# Altium project openEPS.PrjPcb (part 4 of 5)

## Sheet LTC3119 Buck Boost Converter.SchDoc
size Letter; Organization: Altium Limited; Address1: L3, 12a Rodborough Rd; Address2: Frenchs Forest; Address3: NSW; Address4: Australia 2086; CopyrightYear: 2019
Used 4 times, as channels U_Solar Power Converter with MPPT1/U_LTC3119 Buck Boost Converter, U_Solar Power Converter with MPPT2/U_LTC3119 Buck Boost Converter, U_Solar Power Converter with MPPT3/U_LTC3119 Buck Boost Converter, U_Solar Power Converter with MPPT4/U_LTC3119 Buck Boost Converter. Parts and nets are listed once, with the designators drawn on the sheet.
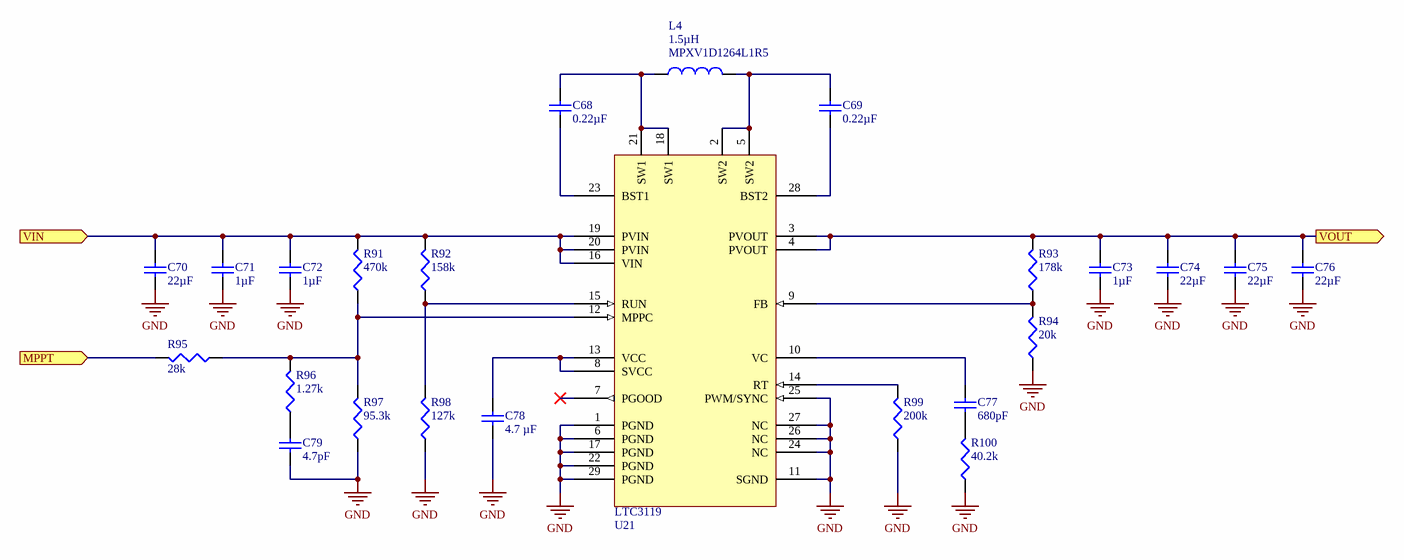
[diagram p17: LTC3119 Buck Boost Converter.SchDoc]

### Parts
C68  value 0.22µF  [TDK-CGA3E]  (hidden comment: Cap)
C69  value 0.22µF  [TDK-CGA3E]  (hidden comment: Cap)
C70  value 22µF  [TDK-C3225]  (hidden comment: Cap)
C71  value 1µF  [TY-0603A]  (hidden comment: Cap)
C72  value 1µF  [TY-0603A]  (hidden comment: Cap)
C73  value 1µF  [TY-0603A]  (hidden comment: Cap)
C74  value 22µF  [TDK-C3225]  (hidden comment: Cap)
C75  value 22µF  [TDK-C3225]  (hidden comment: Cap)
C76  value 22µF  [TDK-C3225]  (hidden comment: Cap)
C77  value 680pF  [TDK-CGA2B]  (hidden comment: Cap)
C78  value 4.7 µF  [MUR-GRM188]  (hidden comment: Cap)
C79  value 4.7pF  [TDK-CGA2B]  (hidden comment: Cap)
L4  value 1.5µH  Manufacturer Part Number: MPXV1D1264L1R5  [KEM-MPXV1D1264L100]  (hidden comment: Inductor)
R91  value 470k  [VSH-0402MCS]  (hidden comment: Res3)
R92  value 158k  [TEC-RP731E]  (hidden comment: Res3)
R93  value 178k  [TEC-RP731E]  (hidden comment: Res3)
R94  value 20k  [TEC-RP731E]  (hidden comment: Res3)
R95  value 28k  [TEC-RP731E]  (hidden comment: Res3)
R96  value 1.27k  [TEC-RP731E]  (hidden comment: Res3)
R97  value 95.3k  [TEC-RP731E]  (hidden comment: Res3)
R98  value 127k  [TEC-RP731E]  (hidden comment: Res3)
R99  value 200k  [TEC-RP731E]  (hidden comment: Res3)
R100  value 40.2k  [TEC-RP731E]  (hidden comment: Res3)
U21  LTC3119  [LT-05-08-1712C]

### Ports
MPPT (in), VIN (in), VOUT (out)

### Nets
GND: C70.1 C71.1 C72.1 C73.1 C74.1 C75.1 C76.1 C78.1 C79.1 R94.1 R97.1 R98.1 R99.1 R100.1 U21.1(PGND) U21.6(PGND) U21.11(SGND) U21.17(PGND) U21.22(PGND) U21.24(NC) U21.25(PWM/SYNC) U21.26(NC) U21.27(NC) U21.29(PGND)
MPPT: R95.2 ; port MPPT
VIN: C70.2 C71.2 C72.2 R91.2 R92.2 U21.16(VIN) U21.19(PVIN) U21.20(PVIN) ; port VIN
VOUT: C73.2 C74.2 C75.2 C76.2 R93.2 U21.3(PVOUT) U21.4(PVOUT) ; port VOUT
NetC68_1: C68.1 U21.23(BST1)
NetC68_2: C68.2 L4.1 U21.18(SW1) U21.21(SW1)
NetC69_1: C69.1 U21.28(BST2)
NetC69_2: C69.2 L4.2 U21.2(SW2) U21.5(SW2)
NetC77_1: C77.1 R100.2
NetC77_2: C77.2 U21.10(VC)
NetC78_2: C78.2 U21.8(SVCC) U21.13(VCC)
NetC79_2: C79.2 R96.1
NetR91_1: R91.1 R95.1 R96.2 R97.2 U21.12(MPPC)
NetR92_1: R92.1 R98.2 U21.15(RUN)
NetR93_1: R93.1 R94.2 U21.9(FB)
NetR99_2: R99.2 U21.14(RT)

Not connected (* = marked no-connect by the designer): U21 7(PGOOD)*

### Channels
U_Solar Power Converter with MPPT1/U_LTC3119 Buck Boost Converter: designators end in _1; ports MPPT=NetQ2_6 VIN=NetC70_1_2 VOUT=NetC73_1_2
U_Solar Power Converter with MPPT2/U_LTC3119 Buck Boost Converter: designators end in _2; ports MPPT=NetQ2_3 VIN=NetC70_2_2 VOUT=NetC73_2_2
U_Solar Power Converter with MPPT3/U_LTC3119 Buck Boost Converter: designators end in _3; ports MPPT=NetQ1_6 VIN=NetC70_3_2 VOUT=NetC73_3_2
U_Solar Power Converter with MPPT4/U_LTC3119 Buck Boost Converter: designators end in _4; ports MPPT=NetQ1_3 VIN=NetC70_4_2 VOUT=NetC73_4_2

### Notes on the sheet
- (the "License"); you may not use or redistribute this file except in compliance with the License. You
- This file and the information within it are licensed under the terms of the Apache License, Version 2.0
- Copyright
- Unless required by applicable law or agreed to in writing, content distributed under the License is
- distributed on an "AS IS" BASIS, WITHOUT WARRANTIES OR CONDITIONS OF ANY KIND,
- either express or implied. See the License for the specific language governing permissions and
- limitations under the License.
- may obtain a copy of the License at:
- http://www.apache.org/licenses/LICENSE-2.0
- Title
- Size:
- Date:
- Letter
- Number:
- Time:
- Revision:
- Sheet
- of
- University of Alberta
- Deptartment of Electrical
- and Computer Engineering
- Edmonton AB, Canada
- T6G 1H9
- File:

### Library data of the parts
C68 C69 = PC-TDK-02393: CAP CER 0.22UF 50V X7R 0603; Manufacturer Part Number: CGA3E3X7R1H224K080AB; Index: 2393; Designator: C?; Tolerance: ±10%; Published: 2016-03-16; LatestRevisionDate: 2016-03-16; LatestRevisionNote: ...; PackageReference: 0603 (1608 Metric); Publisher: AlbertaSat; PackageDescription: Radial Cap, Thru-Hole; 2 Leads; 0.3 in Pin Spacing; Part Number: PC-TDK-02393; Supplier Part Number 1: 445-6926-1-ND; Supplier 1: Digi-key; Supplier Link: http://www.digikey.ca/product-search/en?keywords=445-6926-1-ND; Voltage - Rated: 50V; Temperature Coefficient: X7R; Applications: Automotive; Operating Temperature: -55°C ~ 125°C
C70 C74-C76 = PC-TDK-02965: CAP CER 22UF 25V X7R 1210; Manufacturer Part Number: C3225X7R1E226M250AB; Index: 2965; Designator: C?; Tolerance: ±20%; Code_IEC: 3225; Published: 2022-10-26; LatestRevisionDate: 2022-10-26; LatestRevisionNote: ...; PackageReference: 1210 (3225 Metric); Publisher: AlbertaSat; PackageDescription: Chip Capacitor, 2-Leads, Body 3.20x2.50mm, IPC Low Density; Part Number: PC-TDK-02965; Supplier Part Number 1: 445-181602-1-ND; Supplier 1: Digi-key; Supplier Part Number 2: 810-C3225X7R1EM250AB; Supplier 2: Mouser; Supplier Link: #https://www.digikey.ca/en/products/detail/tdk-corporation/C3225X7R1E226M250AB/9991387#; Voltage - Rated: 25V; Temperature Coefficient: X7R; Applications: General Purpose; Code_JEITA: 1210; Operating Temperature: -55°C ~ 125°C
C71-C73 = PC-TY-00404: CAP CER 1UF 50V X7R 0603; Manufacturer Part Number: UMK107AB7105KA-T; Index: 404; Designator: C?; Tolerance: ±10%; Published: 2016-03-13; LatestRevisionDate: 2016-03-13; LatestRevisionNote: ...; PackageReference: 0603 (1608 Metric); Publisher: AlbertaSat; PackageDescription: Chip Capacitor, 2-Leads, Body 1.60x0.80mm, IPC Low Density; Part Number: PC-TY-00404; Supplier Part Number 1: 587-3247-1-ND; Supplier 1: Digi-key; Supplier Link: http://www.digikey.ca/product-search/en?keywords=587-3247-1-ND; Voltage-Rated: 50V; Temperature Coefficient: X7R; Application: General Purpose; Operating Temperature: -55°C ~ 125°C
C77 = PC-TDK-01417: CAP CER 680PF 100V C0G 0402; Manufacturer Part Number: CGA2B1C0G2A681J050BC; Index: 1417; Designator: C?; Tolerance: ±5%; Temperature Coefficient: NP0; Published: 2016-03-16; LatestRevisionDate: 2016-03-16; LatestRevisionNote: ...; PackageReference: 0402 (1005 Metric); Publisher: AlbertaSat; PackageDescription: Radial Cap, Thru-Hole; 2 Leads; 0.3 in Pin Spacing; Part Number: PC-TDK-01417; Supplier Part Number 1: 445-172680-1-ND; Supplier 1: Digi-key; Supplier Link: http://www.digikey.ca/product-search/en?keywords=445-172680-1-ND; Voltage - Rated: 100V; Applications: Automotive; Operating Temperature: -55°C ~ 125°C
C78 = 10165: CAP CER 4.7UF 16V X7R 0603; Part Number: 10165; Manufacturer Part Number: GRM188Z71C475KE21D; Designator: C?; Tolerance: ±10%; Voltage - Rated: 25V; Published: 8-Jun-2000; LatestRevisionDate: 17-Jul-2002; LatestRevisionNote: Re-released for DXP Platform.; PackageReference: 0603 (1608 Metric); Publisher: Altium Limited; PackageDescription: Chip Capacitor, 2-Leads, Body 1.60x0.80mm, IPC Low Density; Supplier Part Number 1: 490-GRM188Z71C475KE21DCT-ND; Supplier 1: Digi-Key; Supplier Link: #https://www.digikey.ca/en/products/detail/murata-electronics/GRM188Z71C475KE21D/13401930#; Temperature Coefficient: X7R; Application: General Purpose; Operating Temperature: -55°C ~ 125°C; Supplier 2: Mouser; Supplier Part Number 2: 81-GRM188Z71C475KE1D
C79 = PC-TDK-01056: CAP CER 4.7PF 50V NP0 0402; Manufacturer Part Number: CGA2B2NP01H4R7C050BA; Index: 1056; Designator: C?; Tolerance: ±0.25pF; Published: 2016-03-16; LatestRevisionDate: 2016-03-16; LatestRevisionNote: ...; PackageReference: 0402 (1005 Metric); Publisher: AlbertaSat; PackageDescription: Radial Cap, Thru-Hole; 2 Leads; 0.3 in Pin Spacing; Part Number: PC-TDK-01056; Supplier Part Number 1: 445-12140-1-ND; Supplier 1: Digi-key; Supplier Link: http://www.digikey.ca/product-search/en?keywords=445-12140-1-ND; Voltage - Rated: 50V; Temperature Coefficient: NP0; Applications: Automotive; Operating Temperature: -55°C ~ 150°C
L4 = PL-KEM-03168: FIXED IND 1.5UH 28.8A 2.9MOHM SM; Code_IEC: 1005; Index: 3168; Designator: L?; Tolerance: ±20%; Published: 2022-11-26; LatestRevisionDate: 2023-05-04; LatestRevisionNote: Added operating temperature; PackageReference: 0.520" L x 0.492" W (13.20mm x 12.50mm); Publisher: AlbertaSat; PackageDescription: Precision Wire Wound Inductor, 2-Leads, Body 13.20x12.50mm, IPC Low Density; Code_JEITA: 0402; Part Number: PL-KEM-03168; Supplier Part Number 1: 399-MPXV1D1264L1R5CT-ND; Supplier 1: Digi-key; Supplier Part Number 2: 80-MPXV1D1264L1R5; Supplier 2: Mouser; Supplier Link: #https://www.digikey.ca/products/en?keywords=399-MPXV1D1264L100CT-ND#; Operating Temperature: -55°C ~ 155°C
R91 = PR-VSH-00330: RES 470K OHM 0.1% 1/16W 0402; Manufacturer Part Number: MCS0402MD4703BE000; Index: 330; Designator: R?; Power - Rated: 0.063W, 1/16W; Temperature Coefficient: ±25ppm/°C; Published: 2023-02-16; LatestRevisionDate: 2023-02-16; LatestRevisionNote: ...; PackageReference: 0402 (1005 Metric); Publisher: AlbertaSat; PackageDescription: Chip Resistor, 2-Leads, Body 1.00x0.50mm, IPC Low Density; Part Number: PR-VSH-00330; Supplier Part Number 1: 62AJ8660; Supplier 1: Newark; Supplier Link: https://www.digikey.ca/products/en?keywords=541-MCS0402MD4703BE000DKR-ND; Tolerance: ±0.1%; Operating Temperature: -55°C ~ 155°C
R92 = 905: RES 158K OHM 0.1% 1/10W 0402; Part Number: 905; Manufacturer Part Number: RP73PF1E158KBTD; Designator: R?; Temperature Coefficient: ±25ppm/°C; Power (Watts): 0.1W, 1/10W; Published: 8-Jun-2000; LatestRevisionDate: 29-May-2009; LatestRevisionNote: IPC-7351 Footprint Added.; PackageReference: 0402 (1005 Metric); Publisher: Altium Limited; PackageDescription: Chip Resistor, 2-Leads, Body 1.00x0.50mm, IPC Low Density; Supplier Part Number 1: A127530CT-ND; Supplier 1: Digi-Key; Supplier Link: http://www.digikey.ca/product-search/en?keywords=A127530CT-ND; Tolerance: ±0.1%; Operating Temperature: -55°C ~ 155°C
R93 = 910: RES 178K OHM 0.1% 1/10W 0402; Part Number: 910; Manufacturer Part Number: RP73PF1E178KBTD; Designator: R?; Temperature Coefficient: ±25ppm/°C; Power (Watts): 0.1W, 1/10W; Published: 8-Jun-2000; LatestRevisionDate: 29-May-2009; LatestRevisionNote: IPC-7351 Footprint Added.; PackageReference: 0402 (1005 Metric); Publisher: Altium Limited; PackageDescription: Chip Resistor, 2-Leads, Body 1.00x0.50mm, IPC Low Density; Supplier Part Number 1: A127535CT-ND; Supplier 1: Digi-Key; Supplier Link: http://www.digikey.ca/product-search/en?keywords=A127535CT-ND; Tolerance: ±0.1%; Operating Temperature: -55°C ~ 155°C
R94 = 819: RES 20K OHM 0.1% 1/10W 0402; Part Number: 819; Manufacturer Part Number: RP73PF1E20KBTD; Designator: R?; Temperature Coefficient: ±25ppm/°C; Power (Watts): 0.1W, 1/10W; Published: 8-Jun-2000; LatestRevisionDate: 29-May-2009; LatestRevisionNote: IPC-7351 Footprint Added.; PackageReference: 0402 (1005 Metric); Publisher: Altium Limited; PackageDescription: Chip Resistor, 2-Leads, Body 1.00x0.50mm, IPC Low Density; Supplier Part Number 1: A127444CT-ND; Supplier 1: Digi-Key; Supplier Link: http://www.digikey.ca/product-search/en?keywords=A127444CT-ND; Tolerance: ±0.1%; Operating Temperature: -55°C ~ 155°C
R95 = 833: RES 28K OHM 0.1% 1/10W 0402; Part Number: 833; Manufacturer Part Number: RP73PF1E28KBTD; Designator: R?; Temperature Coefficient: ±25ppm/°C; Power (Watts): 0.1W, 1/10W; Published: 8-Jun-2000; LatestRevisionDate: 29-May-2009; LatestRevisionNote: IPC-7351 Footprint Added.; PackageReference: 0402 (1005 Metric); Publisher: Altium Limited; PackageDescription: Chip Resistor, 2-Leads, Body 1.00x0.50mm, IPC Low Density; Supplier Part Number 1: A127458CT-ND; Supplier 1: Digi-Key; Supplier Link: http://www.digikey.ca/product-search/en?keywords=A127458CT-ND; Tolerance: ±0.1%; Operating Temperature: -55°C ~ 155°C
R96 = 704: RES 1.27K OHM 0.1% 1/10W 0402; Part Number: 704; Manufacturer Part Number: RP73PF1E1K27BTD; Designator: R?; Temperature Coefficient: ±25ppm/°C; Power (Watts): 0.1W, 1/10W; Published: 8-Jun-2000; LatestRevisionDate: 29-May-2009; LatestRevisionNote: IPC-7351 Footprint Added.; PackageReference: 0402 (1005 Metric); Publisher: Altium Limited; PackageDescription: Chip Resistor, 2-Leads, Body 1.00x0.50mm, IPC Low Density; Supplier Part Number 1: A127329CT-ND; Supplier 1: Digi-Key; Supplier Link: http://www.digikey.ca/product-search/en?keywords=A127329CT-ND; Tolerance: ±0.1%; Operating Temperature: -55°C ~ 155°C
R97 = 884: RES 95.3K OHM 0.1% 1/10W 0402; Part Number: 884; Manufacturer Part Number: RP73PF1E95K3BTD; Designator: R?; Temperature Coefficient: ±25ppm/°C; Power (Watts): 0.1W, 1/10W; Published: 8-Jun-2000; LatestRevisionDate: 29-May-2009; LatestRevisionNote: IPC-7351 Footprint Added.; PackageReference: 0402 (1005 Metric); Publisher: Altium Limited; PackageDescription: Chip Resistor, 2-Leads, Body 1.00x0.50mm, IPC Low Density; Supplier Part Number 1: A127509CT-ND; Supplier 1: Digi-Key; Supplier Link: http://www.digikey.ca/product-search/en?keywords=A127509CT-ND; Tolerance: ±0.1%; Operating Temperature: -55°C ~ 155°C
R98 = 896: RES 127K OHM 0.1% 1/10W 0402; Part Number: 896; Manufacturer Part Number: RP73PF1E127KBTD; Designator: R?; Temperature Coefficient: ±25ppm/°C; Power (Watts): 0.1W, 1/10W; Published: 8-Jun-2000; LatestRevisionDate: 29-May-2009; LatestRevisionNote: IPC-7351 Footprint Added.; PackageReference: 0402 (1005 Metric); Publisher: Altium Limited; PackageDescription: Chip Resistor, 2-Leads, Body 1.00x0.50mm, IPC Low Density; Supplier Part Number 1: A127521CT-ND; Supplier 1: Digi-Key; Supplier Link: http://www.digikey.ca/product-search/en?keywords=A127521CT-ND; Tolerance: ±0.1%; Operating Temperature: -55°C ~ 155°C
R99 = 915: RES 200K OHM 0.1% 1/10W 0402; Part Number: 915; Manufacturer Part Number: RP73PF1E200KBTD; Designator: R?; Temperature Coefficient: ±25ppm/°C; Power (Watts): 0.1W, 1/10W; Published: 8-Jun-2000; LatestRevisionDate: 29-May-2009; LatestRevisionNote: IPC-7351 Footprint Added.; PackageReference: 0402 (1005 Metric); Publisher: Altium Limited; PackageDescription: Chip Resistor, 2-Leads, Body 1.00x0.50mm, IPC Low Density; Supplier Part Number 1: A127540CT-ND; Supplier 1: Digi-Key; Supplier Link: http://www.digikey.ca/product-search/en?keywords=A127540CT-ND; Tolerance: ±0.1%; Operating Temperature: -55°C ~ 155°C
R100 = 848: RES 40.2K OHM 0.1% 1/10W 0402; Part Number: 848; Manufacturer Part Number: RP73PF1E40K2BTD; Designator: R?; Temperature Coefficient: ±25ppm/°C; Power (Watts): 0.1W, 1/10W; Published: 8-Jun-2000; LatestRevisionDate: 29-May-2009; LatestRevisionNote: IPC-7351 Footprint Added.; PackageReference: 0402 (1005 Metric); Publisher: Altium Limited; PackageDescription: Chip Resistor, 2-Leads, Body 1.00x0.50mm, IPC Low Density; Supplier Part Number 1: A127473CT-ND; Supplier 1: Digi-Key; Supplier Link: http://www.digikey.ca/product-search/en?keywords=A127473CT-ND; Tolerance: ±0.1%; Operating Temperature: -55°C ~ 155°C
U21 = PU-LTC-00059: IC REG BCK BST ADJ 5A 28QFN; Manufacturer Part Number: LTC3119IUFD#PBF; Index: 59; Designator: U?; Part Number: PU-LTC-00059; Supplier Part Number 1: 505-LTC3119IUFD#PBF-ND; Supplier 1: Digi-key; Supplier Part Number 2: 584-LTC3119IUFD#PBF; Supplier 2: Mouser; Publisher: AlbertaSat; Published: 2023-02-14; LatestRevisionDate: 2023-02-14; LatestRevisionNote: ...; PackageReference: 28-QFN (4x5); Supplier Link: https://www.digikey.ca/en/products/detail/analog-devices-inc/LTC3119IUFD-PBF/6419504; Operating Temperature: -40°C ~ 125°C (TA)

## Sheet TMS570LS1224 Microcontroller.SchDoc
size Letter
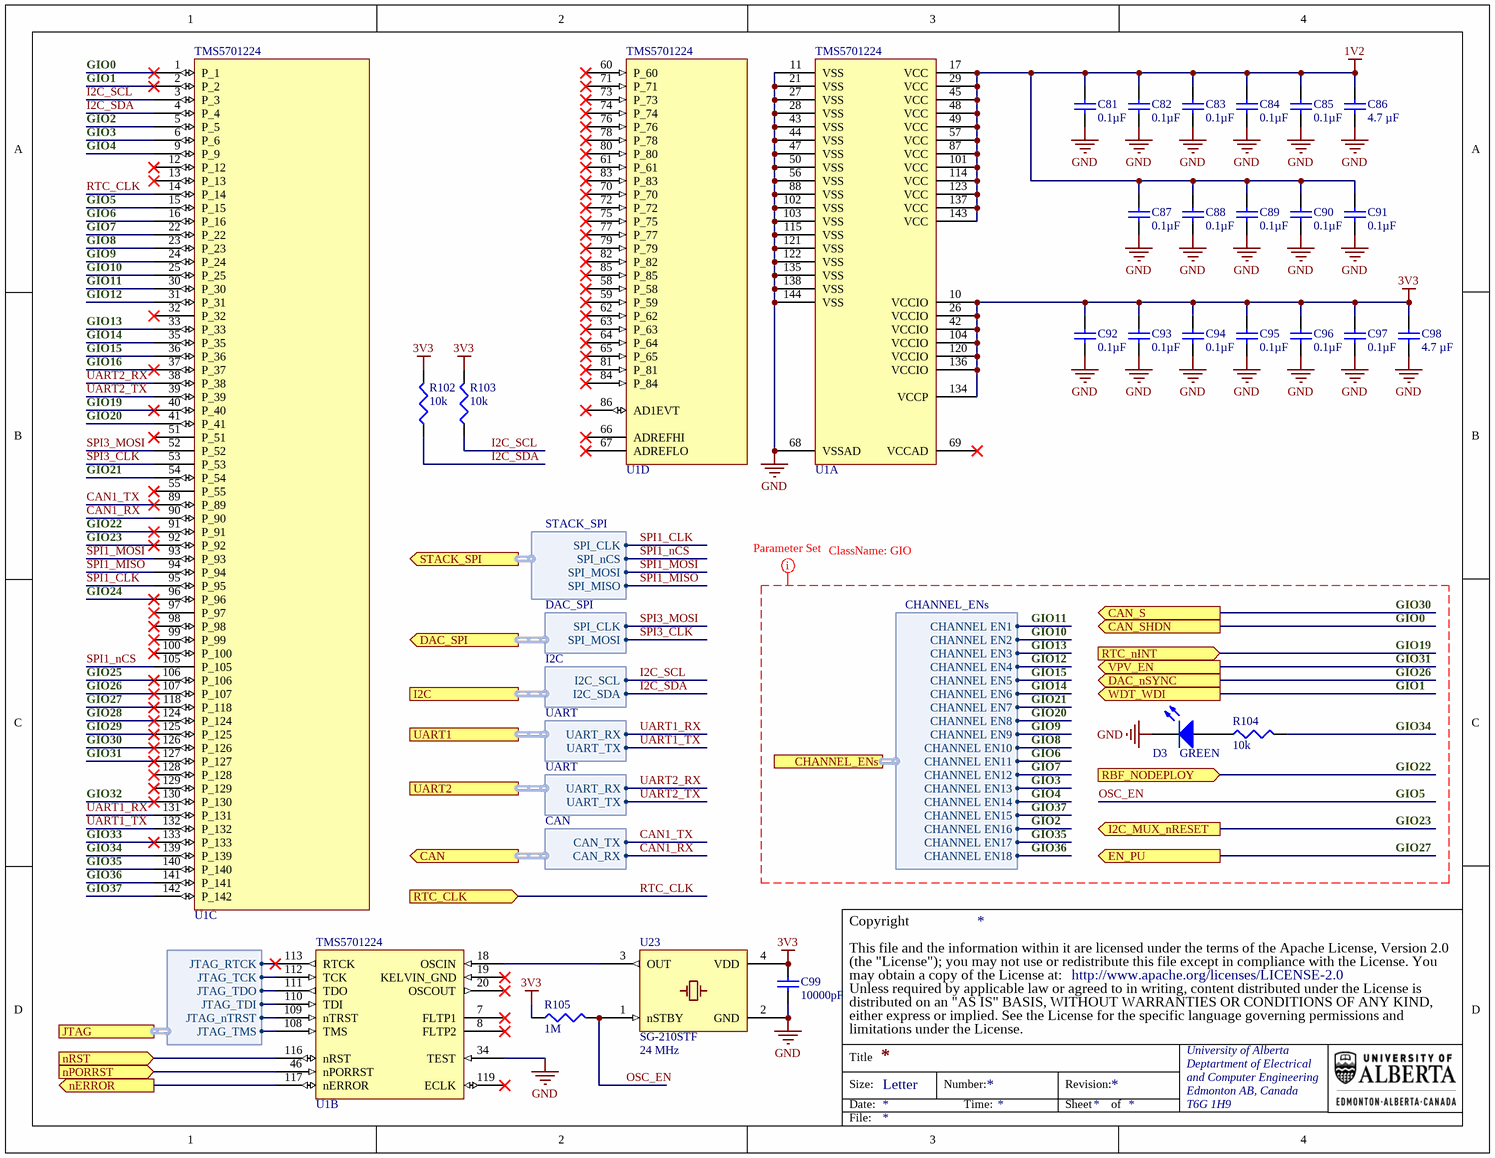
[diagram p18: TMS570LS1224 Microcontroller.SchDoc]

### Parts
C81  value 0.1µF  [TDK-CGA2B]  (hidden comment: Cap)
C82  value 0.1µF  [TDK-CGA2B]  (hidden comment: Cap)
C83  value 0.1µF  [TDK-CGA2B]  (hidden comment: Cap)
C84  value 0.1µF  [TDK-CGA2B]  (hidden comment: Cap)
C85  value 0.1µF  [TDK-CGA2B]  (hidden comment: Cap)
C86  value 4.7 µF  [MUR-GRM188]  (hidden comment: Cap)
C87  value 0.1µF  [TDK-CGA2B]  (hidden comment: Cap)
C88  value 0.1µF  [TDK-CGA2B]  (hidden comment: Cap)
C89  value 0.1µF  [TDK-CGA2B]  (hidden comment: Cap)
C90  value 0.1µF  [TDK-CGA2B]  (hidden comment: Cap)
C91  value 0.1µF  [TDK-CGA2B]  (hidden comment: Cap)
C92  value 0.1µF  [TDK-CGA2B]  (hidden comment: Cap)
C93  value 0.1µF  [TDK-CGA2B]  (hidden comment: Cap)
C94  value 0.1µF  [TDK-CGA2B]  (hidden comment: Cap)
C95  value 0.1µF  [TDK-CGA2B]  (hidden comment: Cap)
C96  value 0.1µF  [TDK-CGA2B]  (hidden comment: Cap)
C97  value 0.1µF  [TDK-CGA2B]  (hidden comment: Cap)
C98  value 4.7 µF  [MUR-GRM188]  (hidden comment: Cap)
C99  value 10000pF  [TDK-CGA2B]  (hidden comment: Cap)
D3  value GREEN  [WL-150060XS75000]  (hidden comment: LED)
R102  value 10k  [PANA-ERJ2R]  (hidden comment: Res3)
R103  value 10k  [PANA-ERJ2R]  (hidden comment: Res3)
R104  value 10k  [PANA-ERJ2R]  (hidden comment: Res3)
R105  value 1M  [PANA-ERJ2R]  (hidden comment: Res3)
U1  TMS5701224  [TI-S-PQFP-G144]  (parts A,B,C,D of 4)
U23  SG-210STF  value 24 MHz  [EPS-SG-210STF]

### Ports
CAN (out, harness CAN), CAN_S (out), CAN_SHDN (out), CHANNEL_ENs (harness CHANNEL_ENs), DAC_nSYNC (out), DAC_SPI (out, harness DAC_SPI), EN_PU (out), I2C (harness I2C), I2C_MUX_nRESET (out), JTAG (harness TMS570_JTAG), nERROR (out), nPORRST (in), nRST (in), RBF_NODEPLOY (in), RTC_CLK (in), RTC_nINT (in), STACK_SPI (out, harness STACK_SPI), UART1 (harness UART), UART2 (harness UART), VPV_EN (out), WDT_WDI (out)

### Harnesses
TMS570_JTAG: JTAG_TMS, JTAG_TCK, JTAG_TDO, JTAG_TDI, JTAG_nTRST, JTAG_RTCK
CHANNEL_ENs: CHANNEL EN1, CHANNEL EN2, CHANNEL EN3, CHANNEL EN4, CHANNEL EN5, CHANNEL EN6, CHANNEL EN7, CHANNEL EN8, CHANNEL EN9, CHANNEL EN10, CHANNEL EN11, CHANNEL EN12, CHANNEL EN13, CHANNEL EN14, CHANNEL EN15, CHANNEL EN16, CHANNEL EN17, CHANNEL EN18
I2C: I2C_SCL, I2C_SDA
UART: UART_TX, UART_RX
CAN: CAN_RX, CAN_TX
DAC_SPI: SPI_MOSI, SPI_CLK
STACK_SPI: SPI_MOSI, SPI_MISO, SPI_CLK, SPI_nCS

### Nets
1V2: C81.2 C82.2 C83.2 C84.2 C85.2 C86.2 C87.2 C88.2 C89.2 C90.2 C91.2 U1.17(VCC) U1.29(VCC) U1.45(VCC) U1.48(VCC) U1.49(VCC) U1.57(VCC) U1.87(VCC) U1.101(VCC) U1.114(VCC) U1.123(VCC) U1.137(VCC) U1.143(VCC)
3V3: C92.2 C93.2 C94.2 C95.2 C96.2 C97.2 C98.2 C99.2 R102.1 R103.1 R105.2 U1.10(VCCIO) U1.26(VCCIO) U1.42(VCCIO) U1.104(VCCIO) U1.120(VCCIO) U1.134(VCCP) U1.136(VCCIO) U23.4(VDD)
GND: C81.1 C82.1 C83.1 C84.1 C85.1 C86.1 C87.1 C88.1 C89.1 C90.1 C91.1 C92.1 C93.1 C94.1 C95.1 C96.1 C97.1 C98.1 C99.1 D3.2(K) U1.11(VSS) U1.21(VSS) U1.27(VSS) U1.28(VSS) U1.34(TEST) U1.43(VSS) U1.44(VSS) U1.47(VSS) U1.50(VSS) U1.56(VSS) U1.68(VSSAD) U1.88(VSS) U1.102(VSS) U1.103(VSS) U1.115(VSS) U1.121(VSS) U1.122(VSS) U1.135(VSS) U1.138(VSS) U1.144(VSS) U23.2(GND)
CAN1_RX: U1.90(P_90) ; port CAN.CAN_RX
CAN1_TX: U1.89(P_89) ; port CAN.CAN_TX
GIO0: U1.1(P_1) ; port CAN_SHDN
GIO1: U1.2(P_2) ; port WDT_WDI
GIO2: U1.5(P_5) ; port CHANNEL_ENs.CHANNEL EN16
GIO3: U1.6(P_6) ; port CHANNEL_ENs.CHANNEL EN13
GIO4: U1.9(P_9) ; port CHANNEL_ENs.CHANNEL EN14
GIO5: R105.1 U1.15(P_15) U23.1(nSTBY)  [also labelled OSC_EN]
GIO6: U1.16(P_16) ; port CHANNEL_ENs.CHANNEL EN11
GIO7: U1.22(P_22) ; port CHANNEL_ENs.CHANNEL EN12
GIO8: U1.23(P_23) ; port CHANNEL_ENs.CHANNEL EN10
GIO9: U1.24(P_24) ; port CHANNEL_ENs.CHANNEL EN9
GIO10: U1.25(P_25) ; port CHANNEL_ENs.CHANNEL EN2
GIO11: U1.30(P_30) ; port CHANNEL_ENs.CHANNEL EN1
GIO12: U1.31(P_31) ; port CHANNEL_ENs.CHANNEL EN4
GIO13: U1.33(P_33) ; port CHANNEL_ENs.CHANNEL EN3
GIO14: U1.35(P_35) ; port CHANNEL_ENs.CHANNEL EN6
GIO15: U1.36(P_36) ; port CHANNEL_ENs.CHANNEL EN5
GIO16: U1.37(P_37)
GIO19: U1.40(P_40) ; port RTC_nINT
GIO20: U1.41(P_41) ; port CHANNEL_ENs.CHANNEL EN8
GIO21: U1.54(P_54) ; port CHANNEL_ENs.CHANNEL EN7
GIO22: U1.91(P_91) ; port RBF_NODEPLOY
GIO23: U1.92(P_92) ; port I2C_MUX_nRESET
GIO24: U1.96(P_96)
GIO25: U1.106(P_106)
GIO26: U1.107(P_107) ; port DAC_nSYNC
GIO27: U1.118(P_118) ; port EN_PU
GIO28: U1.124(P_124)
GIO29: U1.125(P_125)
GIO30: U1.126(P_126) ; port CAN_S
GIO31: U1.127(P_127) ; port VPV_EN
GIO32: U1.130(P_130)
GIO33: U1.133(P_133)
GIO34: R104.1 U1.139(P_139)
GIO35: U1.140(P_140) ; port CHANNEL_ENs.CHANNEL EN17
GIO36: U1.141(P_141) ; port CHANNEL_ENs.CHANNEL EN18
GIO37: U1.142(P_142) ; port CHANNEL_ENs.CHANNEL EN15
I2C_SCL: R103.2 U1.3(P_3) ; port I2C.I2C_SCL
I2C_SDA: R102.2 U1.4(P_4) ; port I2C.I2C_SDA
RTC_CLK: U1.14(P_14) ; port RTC_CLK
SPI1_CLK: U1.95(P_95) ; port STACK_SPI.SPI_CLK
SPI1_MISO: U1.94(P_94) ; port STACK_SPI.SPI_MISO
SPI1_MOSI: U1.93(P_93) ; port STACK_SPI.SPI_MOSI
SPI1_nCS: U1.105(P_105) ; port STACK_SPI.SPI_nCS
SPI3_CLK: U1.53(P_53) ; port DAC_SPI.SPI_MOSI
SPI3_MOSI: U1.52(P_52) ; port DAC_SPI.SPI_CLK
UART1_RX: U1.131(P_131) ; port UART1.UART_RX
UART1_TX: U1.132(P_132) ; port UART1.UART_TX
UART2_RX: U1.38(P_38) ; port UART2.UART_RX
UART2_TX: U1.39(P_39) ; port UART2.UART_TX
NetD3_1: D3.1(A) R104.2
NetR1_2: U1.46(nPORRST) ; port nPORRST
NetR2_2: U1.116(nRST) ; port nRST
NetR52_1: U1.117(nERROR) ; port nERROR
NetR57_1: U1.111(TDO) ; port JTAG.JTAG_TDO
NetU1_18: U1.18(OSCIN) U23.3(OUT)
NetU1_108: U1.108(TMS) ; port JTAG.JTAG_TMS
NetU1_109: U1.109(nTRST) ; port JTAG.JTAG_nTRST
NetU1_110: U1.110(TDI) ; port JTAG.JTAG_TDI
NetU1_112: U1.112(TCK) ; port JTAG.JTAG_TCK
NetU1_113: U1.113(RTCK) ; port JTAG.JTAG_RTCK

Not connected (* = marked no-connect by the designer): U1 7(FLTP1)* 8(FLTP2)* 12(P_12)* 13(P_13)* 19(KELVIN_GND)* 20(OSCOUT)* 32(P_32)* 51(P_51)* 55(P_55)* 58(P_58)* 59(P_59)* 60(P_60)* 61(P_61)* 62(P_62)* 63(P_63)* 64(P_64)* 65(P_65)* 66(ADREFHI)* 67(ADREFLO)* 69(VCCAD)* 70(P_70)* 71(P_71)* 72(P_72)* 73(P_73)* 74(P_74)* 75(P_75)* 76(P_76)* 77(P_77)* 78(P_78)* 79(P_79)* 80(P_80)* 81(P_81)* 82(P_82)* 83(P_83)* 84(P_84)* 85(P_85)* 86(AD1EVT)* 97(P_97)* 98(P_98)* 99(P_99)* 100(P_100)* 119(ECLK)* 128(P_128)* 129(P_129)*

### Layout directives
net class GIO: GIO0, GIO1, GIO2, GIO3, GIO4, GIO5, GIO6, GIO7, GIO8, GIO9, GIO10, GIO11, GIO12, GIO13, GIO14, GIO15, GIO19, GIO20, GIO21, GIO22, GIO23, GIO26, GIO27, GIO30, GIO31, GIO34, GIO35, GIO36, GIO37, GND, OSC_EN

### Notes on the sheet
- (the "License"); you may not use or redistribute this file except in compliance with the License. You
- This file and the information within it are licensed under the terms of the Apache License, Version 2.0
- Copyright
- Unless required by applicable law or agreed to in writing, content distributed under the License is
- distributed on an "AS IS" BASIS, WITHOUT WARRANTIES OR CONDITIONS OF ANY KIND,
- either express or implied. See the License for the specific language governing permissions and
- limitations under the License.
- may obtain a copy of the License at:
- http://www.apache.org/licenses/LICENSE-2.0
- Title
- Size:
- Date:
- Letter
- Number:
- Time:
- Revision:
- Sheet
- of
- University of Alberta
- Deptartment of Electrical
- and Computer Engineering
- Edmonton AB, Canada
- T6G 1H9
- File:

### Library data of the parts
C81-C85 C87-C97 = PC-TDK-02259: CAP CER 0.1UF 50V X7R 0402; Manufacturer Part Number: CGA2B3X7R1H104K050BB; Index: 2259; Designator: C?; Tolerance: ±10%; Published: 2016-03-16; LatestRevisionDate: 2016-03-16; LatestRevisionNote: ...; PackageReference: 0402 (1005 Metric); Publisher: AlbertaSat; PackageDescription: Radial Cap, Thru-Hole; 2 Leads; 0.3 in Pin Spacing; Part Number: PC-TDK-02259; Supplier Part Number 1: 445-6899-1-ND; Supplier 1: Digi-key; Supplier Link: http://www.digikey.ca/product-search/en?keywords=445-6899-1-ND; Voltage - Rated: 50V; Temperature Coefficient: X7R; Applications: Automotive; Operating Temperature: -55°C ~ 125°C
C86 C98 = 10165: as C78 on sheet LTC3119 Buck Boost Converter; Published: 8-Jun-2000; LatestRevisionDate: 17-Jul-2002; LatestRevisionNote: Re-released for DXP Platform.; PackageReference: 0603 (1608 Metric); Publisher: Altium Limited; PackageDescription: Chip Capacitor, 2-Leads, Body 1.60x0.80mm, IPC Low Density; Supplier Part Number 1: 490-GRM188Z71C475KE21DCT-ND; Supplier 1: Digi-Key; Supplier Link: #https://www.digikey.ca/en/products/detail/murata-electronics/GRM188Z71C475KE21D/13401930#; Temperature Coefficient: X7R; Application: General Purpose; Operating Temperature: -55°C ~ 125°C; Supplier 2: Mouser; Supplier Part Number 2: 81-GRM188Z71C475KE1D
C99 = PC-TDK-01877: CAP CER 10000PF 50V X8R 0402; Manufacturer Part Number: CGA2B3X8R1H103K050BB; Index: 1877; Designator: C?; Tolerance: ±10%; Published: 2016-03-16; LatestRevisionDate: 2016-03-16; LatestRevisionNote: ...; PackageReference: 0402 (1005 Metric); Publisher: AlbertaSat; PackageDescription: Radial Cap, Thru-Hole; 2 Leads; 0.3 in Pin Spacing; Part Number: PC-TDK-01877; Supplier Part Number 1: 445-12303-1-ND; Supplier 1: Digi-key; Supplier Link: http://www.digikey.ca/product-search/en?keywords=445-12303-1-ND; Voltage - Rated: 50V; Temperature Coefficient: X8R; Applications: Automotive; Operating Temperature: -55°C ~ 150°C
D3 = 2: LED GREEN CLEAR 0603 SMD; Part Number: 2; Manufacturer Part Number: 150060GS75000; Designator: D?; Brightness: 430mcd; Published: 8-Jun-2000; LatestRevisionDate: 08-Jul-2005; LatestRevisionNote: Mech Layer 1 removed.; PackageReference: WL-150060XS75000; Publisher: Altium Limited; PackageDescription: LED; 2 Leads; Supplier Part Number 1: 732-4971-1-ND; Supplier 1: Digi-Key; Supplier Link: http://www.digikey.ca/product-search/en?keywords=732-4971-1-ND; Operating Temperature: -40°C ~ 85°C (TA)
R102-R104 = 17198: RES SMD 10K OHM 1% 1/10W 0402; Part Number: 17198; Manufacturer Part Number: ERJ-2RKF1002X; Designator: R?; Power: 0.1W, 1/10W; Temperature Coefficient: ±100ppm/°C; Published: 8-Jun-2000; LatestRevisionDate: 29-May-2009; LatestRevisionNote: IPC-7351 Footprint Added.; PackageReference: 0402 (1005 Metric); Publisher: Altium Limited; PackageDescription: Chip Resistor, 2-Leads, Body 1.00x0.50mm, IPC Low Density; Supplier Part Number 1: P10.0KLCT-ND; Supplier 1: Digi-Key; Supplier Link: http://www.digikey.ca/product-search/en?keywords=P10.0KLCT-ND; Tolerance: ±1%; Operating Temperature: -55°C ~ 155°C
R105 = 19704: RES SMD 1M OHM 1% 1/10W 0402; Part Number: 19704; Manufacturer Part Number: ERJ-2RKF1004X; Designator: R?; Power: 0.1W, 1/10W; Temperature Coefficient: ±100ppm/°C; Published: 8-Jun-2000; LatestRevisionDate: 29-May-2009; LatestRevisionNote: IPC-7351 Footprint Added.; PackageReference: 0402 (1005 Metric); Publisher: Altium Limited; PackageDescription: Chip Resistor, 2-Leads, Body 1.00x0.50mm, IPC Low Density; Supplier Part Number 1: P1.00MLCT-ND; Supplier 1: Digi-Key; Supplier Link: http://www.digikey.ca/product-search/en?keywords=P1.00MLCT-ND; Tolerance: ±1%; Operating Temperature: -55°C ~ 155°C
U1 = 59: IC MCU 32BIT 1.25MB FLASH 144QFP; Part Number: 59; Core Processor: Arm-Cortex - R4F; Core Size: 32-Bit; Speed: 160MHz; Program Memory Size: 1280KB (1280K x 8); RAM Size: 192K (192K X 8); Designator: U?; Supplier Part Number 2: 595-MS5701224CPGEQQ1; Supplier 2: Mouser; Manufacturer Part Number: TMS5701224CPGEQQ1; Supplier Part Number 1: 296-47200-ND; Supplier 1: Digi-Key; Supplier Link: #https://www.digikey.ca/product-detail/en/texas-instruments/TMS5701224CPGEQQ1/296-47200-ND/5414218#; PackageReference: 144-LQFP; Operating Temperature: -40°C ~ 125°C (TA)
U23 = PU-EPS-00002: XTAL OSC XO 24.0000MHZ CMOS SMD; Manufacturer Part Number: SG-210STF 24.0000MY0; Index: 2; Designator: U?; Frequency Stability: ±50ppm; Voltage - Supply: 1.6V ~ 3.63V; Current - Supply (Max): 2.2mA; Part Number: PU-EPS-00002; Supplier Part Number 1: 114-SG-210STF24.0000MY0CT-ND; Supplier 1: Digi-key; Supplier Part Number 2: 732-SG10STF240000MY0; Supplier 2: Mouser; Publisher: AlbertaSat; Published: 2023-05-04; LatestRevisionDate: 2023-05-04; LatestRevisionNote: ...; PackageReference: 4-SMD, No Lead; PackageDescription: DFN, 4-Leads, Body 2.00x2.50mm, Pitch 1.65mm, IPC Low Density; Supplier Link: #https://www.digikey.ca/en/products/detail/epson/SG-210STF-24-0000MY0/13645780?s=N4IgTCBcDaIMoHEC0YCMAGOAVAYgAjABYA6dM9AWQE10QBdAXyA#; Operating Temperature: -40°C ~ 105°C

## Sheet Battery Voltage Monitor.SchDoc: INA381A Overcurrent Protection
size Letter; SheetNumber: 21
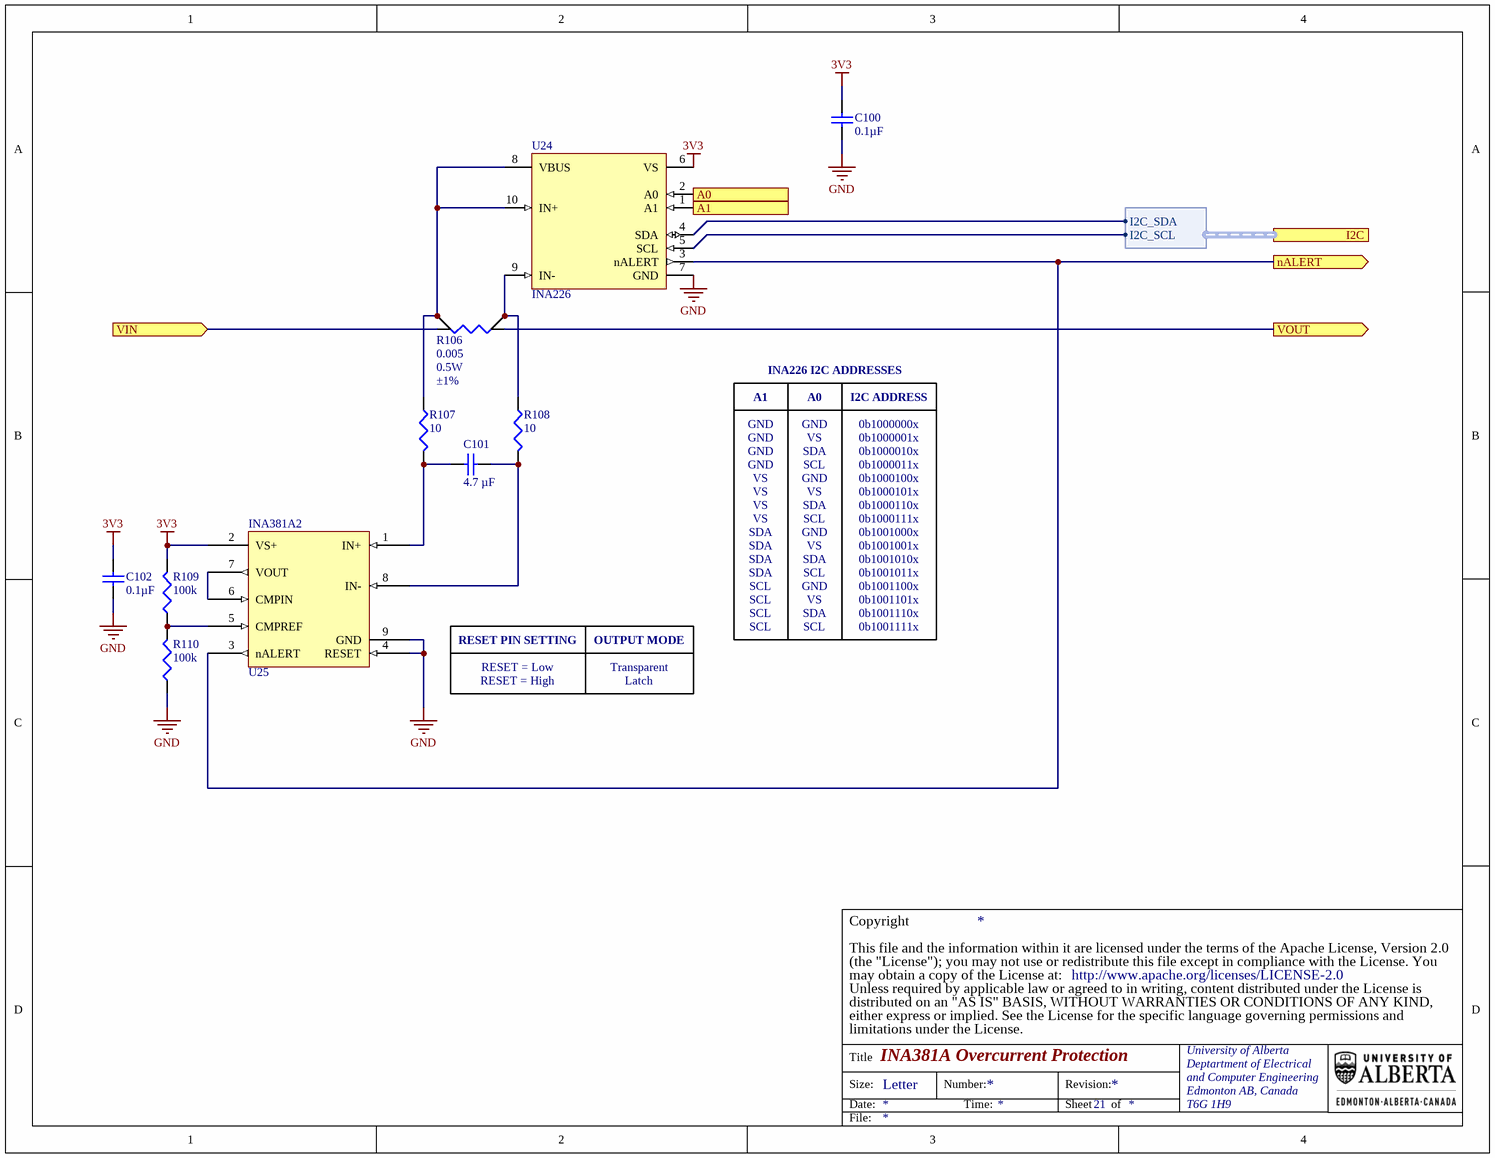
[diagram p19: Battery Voltage Monitor.SchDoc]

### Parts
C100  value 0.1µF  [TDK-CGA2B]  (hidden comment: Cap)
C101  value 4.7 µF  [MUR-GRM188]  (hidden comment: Cap)
C102  value 0.1µF  [TDK-CGA2B]  (hidden comment: Cap)
R106  value 0.005  Power - Rated: 0.5W  Tolerance: ±1%  [BRN-CRF0805]  (hidden comment: Res Sense)
R107  value 10  [PANA-ERA2A]  (hidden comment: Res3)
R108  value 10  [PANA-ERA2A]  (hidden comment: Res3)
R109  value 100k  [PANA-ERJ2R]  (hidden comment: Res3)
R110  value 100k  [PANA-ERJ2R]  (hidden comment: Res3)
U24  INA226  [TI-DGS]
U25  INA381A2  [TI-DSG0008A]

### Ports
A0 (in), A1 (in), I2C (harness INA226_I2C), nALERT (out), VIN (in), VOUT (out)

### Harnesses
INA226_I2C: I2C_SCL, I2C_SDA

### Nets
3V3: C100.2 C102.2 R109.2 U24.1(A1) U24.6(VS) U25.2(VS+) ; port A1
GND: C100.1 C102.1 R110.1 U24.2(A0) U24.7(GND) U25.4(RESET) U25.9(GND) ; port A0
VBATT_BUS: R106.1(I1) ; port VOUT
VBATT_SWITCHED: R106.2(I2) ; port VIN
I2C0.I2C_SCL: U24.5(SCL) ; port I2C.I2C_SCL
I2C0.I2C_SDA: U24.4(SDA) ; port I2C.I2C_SDA
NetC101_1: C101.1 R108.2 U25.8(IN-)
NetC101_2: C101.2 R107.2 U25.1(IN+)
NetR52_1: U24.3(nALERT) U25.3(nALERT) ; port nALERT
NetR106_3: R106.3(S2) R107.1 U24.8(VBUS) U24.10(IN+)
NetR106_4: R106.4(S1) R108.1 U24.9(IN-)
NetR109_1: R109.1 R110.2 U25.5(CMPREF)
NetU25_6: U25.6(CMPIN) U25.7(VOUT)

### Notes on the sheet
- INA226 I2C ADDRESSES
- A1
- GND
- A0
- VS
- I2C ADDRESS
- 0b1000000x
- 0b1000001x
- SDA
- SCL
- 0b1000010x
- 0b1000011x
- 0b1000100x
- 0b1000101x
- 0b1000110x
- 0b1000111x
- 0b1001000x
- 0b1001001x
- 0b1001010x
- 0b1001011x
- RESET PIN SETTING
- OUTPUT MODE
- 0b1001100x
- 0b1001101x
- 0b1001110x
- 0b1001111x
- RESET = Low
- RESET = High
- Transparent
- Latch
- (the "License"); you may not use or redistribute this file except in compliance with the License. You
- This file and the information within it are licensed under the terms of the Apache License, Version 2.0
- Copyright
- Unless required by applicable law or agreed to in writing, content distributed under the License is
- distributed on an "AS IS" BASIS, WITHOUT WARRANTIES OR CONDITIONS OF ANY KIND,
- either express or implied. See the License for the specific language governing permissions and
- limitations under the License.
- may obtain a copy of the License at:
- http://www.apache.org/licenses/LICENSE-2.0
- Title
- Size:
- Date:
- Letter
- Number:
- Time:
- Revision:
- Sheet
- of
- University of Alberta
- Deptartment of Electrical
- and Computer Engineering
- Edmonton AB, Canada
- T6G 1H9
- File:

### Library data of the parts
C100 C102 = PC-TDK-02259: as C81 on sheet TMS570LS1224 Microcontroller; Published: 2016-03-16; LatestRevisionDate: 2016-03-16; LatestRevisionNote: ...; PackageReference: 0402 (1005 Metric); Publisher: AlbertaSat; PackageDescription: Radial Cap, Thru-Hole; 2 Leads; 0.3 in Pin Spacing; Part Number: PC-TDK-02259; Supplier Part Number 1: 445-6899-1-ND; Supplier 1: Digi-key; Supplier Link: http://www.digikey.ca/product-search/en?keywords=445-6899-1-ND; Voltage - Rated: 50V; Temperature Coefficient: X7R; Applications: Automotive; Operating Temperature: -55°C ~ 125°C
C101 = 10165: as C78 on sheet LTC3119 Buck Boost Converter; Published: 8-Jun-2000; LatestRevisionDate: 17-Jul-2002; LatestRevisionNote: Re-released for DXP Platform.; PackageReference: 0603 (1608 Metric); Publisher: Altium Limited; PackageDescription: Chip Capacitor, 2-Leads, Body 1.60x0.80mm, IPC Low Density; Supplier Part Number 1: 490-GRM188Z71C475KE21DCT-ND; Supplier 1: Digi-Key; Supplier Link: #https://www.digikey.ca/en/products/detail/murata-electronics/GRM188Z71C475KE21D/13401930#; Temperature Coefficient: X7R; Application: General Purpose; Operating Temperature: -55°C ~ 125°C; Supplier 2: Mouser; Supplier Part Number 2: 81-GRM188Z71C475KE1D
R106 = PR-BRN-00023: RES 0.005 OHM 1% 1/2W 0805; Manufacturer Part Number: CRF0805-FZ-R005ELF; Index: 23; Designator: R?; Temperature Coefficient: ±50ppm/°C; Part Number: PR-BRN-00023; Supplier Part Number 1: CRF0805-FZ-R005ELFCT-ND; Supplier 1: Digi-key; Supplier Part Number 2: 652-CRF0805FZR005ELF; Supplier 2: Mouser; Publisher: AlbertaSat; Published: 2022-11-26; LatestRevisionDate: 2023-05-04; LatestRevisionNote: Added operating temperature; PackageReference: BRN-CRF0805; Supplier Link: #https://www.digikey.ca/en/products/detail/bourns-inc/CRF0805-FZ-R005ELF/6210977#; Operating Temperature: -55°C ~ 170°C
R107 R108 = 13235: RES SMD 10 OHM 0.5% 1/16W 0402; Part Number: 13235; Manufacturer Part Number: ERA-2AKD100X; Designator: R?; Power: 0.063W, 1/16W; Temperature Coefficient: ±100ppm/°C; Published: 8-Jun-2000; LatestRevisionDate: 29-May-2009; LatestRevisionNote: IPC-7351 Footprint Added.; PackageReference: 0402 (1005 Metric); Publisher: Altium Limited; PackageDescription: Chip Resistor, 2-Leads, Body 1.00x0.50mm, IPC Low Density; Supplier Part Number 1: P10DDCT-ND; Supplier 1: Digi-Key; Supplier Link: http://www.digikey.ca/product-search/en?keywords=P10DDCT-ND; Tolerance: ±0.5%; Operating Temperature: -55°C ~ 155°C
R109 R110 = 18739: as R74-R76 on sheet TPS53319 3.3V Buck Converter; Published: 8-Jun-2000; LatestRevisionDate: 29-May-2009; LatestRevisionNote: IPC-7351 Footprint Added.; PackageReference: 0402 (1005 Metric); Publisher: Altium Limited; PackageDescription: Chip Resistor, 2-Leads, Body 1.00x0.50mm, IPC Low Density; Supplier Part Number 1: P100KLCT-ND; Supplier 1: Digi-Key; Supplier Link: http://www.digikey.ca/product-search/en?keywords=P100KLCT-ND; Tolerance: ±1%; Operating Temperature: -55°C ~ 155°C
U24 = 19: IC MONITOR PWR/CURR BIDIR 10MSOP; Part Number: 19; Manufacturer Part Number: INA226AQDGSRQ1; Designator: U?; Supplier Part Number 2: 595-INA226AQDGSRQ1; Supplier 2: Mouser; Supplier Part Number 1: 296-42503-1-ND; Supplier 1: Digi-Key; Supplier Link: #https://www.digikey.com/product-detail/en/texas-instruments/INA226AQDGSRQ1/296-42503-1-ND/5416001#; PackageReference: TI-MSOP10; Operating Temperature: -40°C ~ 125°C
U25 = 110: CURRENT SENSE AMPLIFIER WITH INT; Part Number: 110; Manufacturer Part Number: INA381A2IDSGT; Designator: U?; Supplier Part Number 2: 595-INA381A2IDSGT; Supplier 2: Mouser; Supplier Part Number 1: 296-49078-1-ND; Supplier 1: Digi-Key; Supplier Link: #https://www.digikey.ca/product-detail/en/texas-instruments/INA381A2IDSGT/296-49078-1-ND/9091891#; PackageReference: 8-WFDFN Exposed Pad; Operating Temperature: -40°C ~ 125°C (TA)

## Sheet FPP Connector.SchDoc: Debug Interface
size Letter; SheetNumber: 17
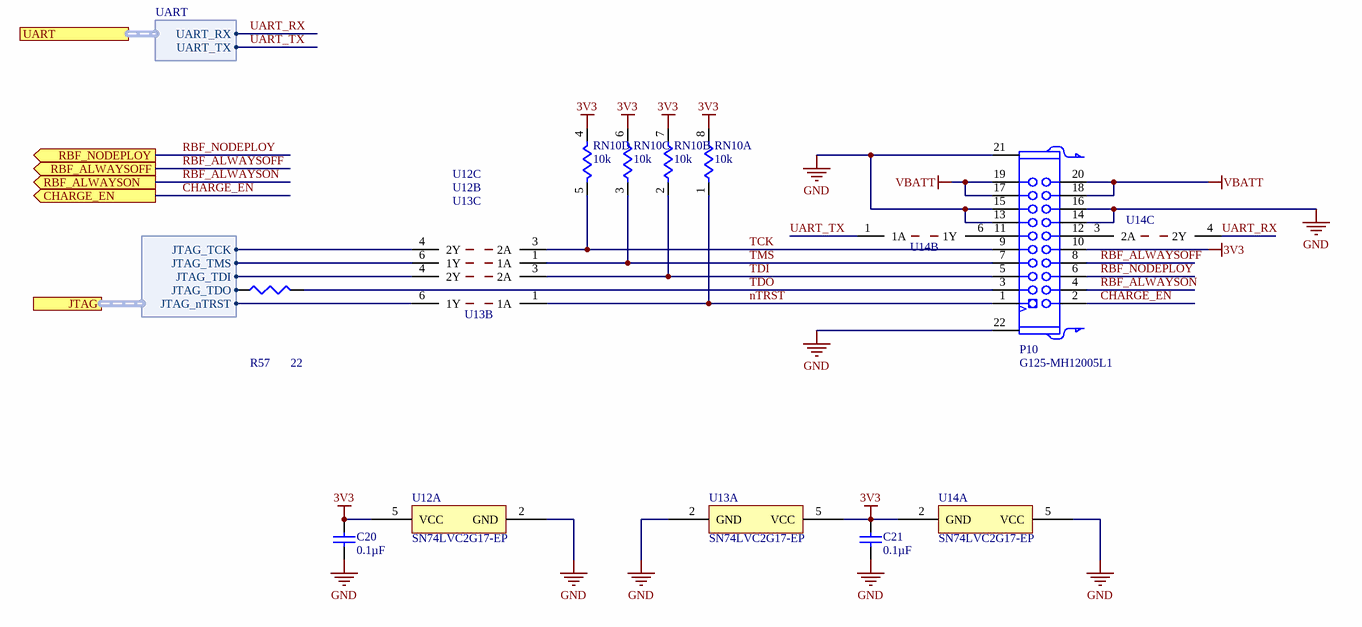
[diagram p20: FPP Connector.SchDoc]

### Parts
C20  value 0.1µF  [TDK-CGA2B]  (hidden comment: Cap)
C21  value 0.1µF  [TDK-CGA2B]  (hidden comment: Cap)
P10  G125-MH12005L1  [HWN-G125-MH12005L1]
R57  value 22  [PANA-ERJ2R]  (hidden comment: Res3)
RN10  value 10k  [PANA-EXB28V]  (hidden comment: Res4 Pack1)  (parts A,B,C,D of 4)
U12  SN74LVC2G17-EP  [TI-R-PDSO-G6]  (parts A,B,C of 3)
U13  SN74LVC2G17-EP  [TI-R-PDSO-G6]  (parts A,B,C of 3)
U14  SN74LVC2G17-EP  [TI-R-PDSO-G6]  (parts A,B,C of 3)

### Ports
CHARGE_EN (out), JTAG (harness DEBUG_JTAG), RBF_ALWAYSOFF (out), RBF_ALWAYSON (out), RBF_NODEPLOY (out), UART (harness UART)

### Harnesses
DEBUG_JTAG: JTAG_TMS, JTAG_TCK, JTAG_TDO, JTAG_TDI, JTAG_nTRST
UART: UART_TX, UART_RX

### Nets
3V3: C20.1 C21.1 P10.10 RN10.4 RN10.6 RN10.7 RN10.8 U12.5(VCC) U13.5(VCC) U14.2(GND)
GND: C20.2 C21.2 P10.13 P10.14 P10.15 P10.16 P10.21 P10.22 U12.2(GND) U13.2(GND) U14.5(VCC)
VBATT: P10.17 P10.18 P10.19 P10.20
CHARGE_EN: P10.2 ; port CHARGE_EN
nTRST: P10.1 RN10.1 U13.1(1A)
RBF_ALWAYSOFF: P10.8 ; port RBF_ALWAYSOFF
RBF_ALWAYSON: P10.4 ; port RBF_ALWAYSON
RBF_NODEPLOY: P10.6 ; port RBF_NODEPLOY  [project net GIO22]
TCK: P10.9 RN10.5 U12.3(2A)
TDI: P10.5 RN10.2 U13.3(2A)
TDO: P10.3 R57.2
TMS: P10.7 RN10.3 U12.1(1A)
UART_RX: U14.4(2Y) ; port UART.UART_RX  [project net UART2_RX]
UART_TX: U14.1(1A) ; port UART.UART_TX  [project net UART2_TX]
NetP10_11: P10.11 U14.6(1Y)
NetP10_12: P10.12 U14.3(2A)
NetR57_1: R57.1 ; port JTAG.JTAG_TDO
NetU1_108: U12.6(1Y) ; port JTAG.JTAG_TMS
NetU1_109: U13.6(1Y) ; port JTAG.JTAG_nTRST
NetU1_110: U13.4(2Y) ; port JTAG.JTAG_TDI
NetU1_112: U12.4(2Y) ; port JTAG.JTAG_TCK

### Notes on the sheet
- (the "License"); you may not use or redistribute this file except in compliance with the License. You
- This file and the information within it are licensed under the terms of the Apache License, Version 2.0
- Copyright
- Unless required by applicable law or agreed to in writing, content distributed under the License is
- distributed on an "AS IS" BASIS, WITHOUT WARRANTIES OR CONDITIONS OF ANY KIND,
- either express or implied. See the License for the specific language governing permissions and
- limitations under the License.
- may obtain a copy of the License at:
- http://www.apache.org/licenses/LICENSE-2.0
- Title
- Size:
- Date:
- Letter
- Number:
- Time:
- Revision:
- Sheet
- of
- University of Alberta
- Deptartment of Electrical
- and Computer Engineering
- Edmonton AB, Canada
- T6G 1H9
- File:

### Library data of the parts
C20 C21 = PC-TDK-02259: as C81 on sheet TMS570LS1224 Microcontroller; Published: 2016-03-16; LatestRevisionDate: 2016-03-16; LatestRevisionNote: ...; PackageReference: 0402 (1005 Metric); Publisher: AlbertaSat; PackageDescription: Radial Cap, Thru-Hole; 2 Leads; 0.3 in Pin Spacing; Part Number: PC-TDK-02259; Supplier Part Number 1: 445-6899-1-ND; Supplier 1: Digi-key; Supplier Link: http://www.digikey.ca/product-search/en?keywords=445-6899-1-ND; Voltage - Rated: 50V; Temperature Coefficient: X7R; Applications: Automotive; Operating Temperature: -55°C ~ 125°C
P10 = PP-HWN-00018: CONN HEADER R/A 20POS 1.25MM; Index: 18; Designator: P?; Part Number: PP-HWN-00018; Manufacturer Part Number: G125-MH12005L1P; Supplier Part Number 1: 952-2699-ND; Supplier 1: Digi-key; Supplier Part Number 2: 855-G125-MH12005L1P; Supplier 2: Mouser; Publisher: AlbertaSat; Published: 2019-07-08; LatestRevisionDate: 2023-05-04; LatestRevisionNote: Added operating temperature; Supplier Link: https://www.digikey.ca/products/en?keywords=952-2699-ND; Operating Temperature: -65°C ~ 150°C
R57 = 13460: RES SMD 22 OHM 1% 1/10W 0402; Part Number: 13460; Manufacturer Part Number: ERJ-2RKF22R0X; Designator: R?; Power: 0.1W, 1/10W; Temperature Coefficient: ±100ppm/°C; Published: 8-Jun-2000; LatestRevisionDate: 29-May-2009; LatestRevisionNote: IPC-7351 Footprint Added.; PackageReference: 0402 (1005 Metric); Publisher: Altium Limited; PackageDescription: Chip Resistor, 2-Leads, Body 1.00x0.50mm, IPC Low Density; Supplier Part Number 1: P22.0LCT-ND; Supplier 1: Digi-Key; Supplier Link: http://www.digikey.ca/product-search/en?keywords=P22.0LCT-ND; Tolerance: ±1%; Operating Temperature: -55°C ~ 155°C
RN10 = 19968: RES ARRAY 4 RES 10K OHM 0804; Part Number: 19968; Manufacturer Part Number: EXB-28V103JX; Sim Note: Enter the Resistance value into parameter field.; Designator: RN?; Tolerance: ±5%; Power: 62.5mW; Temperature Coefficient: ±200ppm/°C; Code_JEDEC: MS-012-AC; Supplier Part Number 1: Y7103CT-ND; Supplier 1: Digi-Key; Supplier Link: http://www.digikey.ca/product-search/en?keywords=Y7103CT-ND; PackageReference: 0804, Convex, Long Side Terminals; Operating Temperature: -55°C ~ 125°C
U12-U14 = 92: IC BUF NON-INVERT 5.5V SC70-6; Part Number: 92; Manufacturer Part Number: SN74LVC2G17MDCKREP; Designator: U?; Voltage - Supply: 1.65V ~ 5.5V; Supplier Part Number 2: 595-SN74L2G17MDCKREP; Supplier 2: Mouser; Supplier Part Number 1: 296-22358-1-ND; Supplier 1: Digi-Key; Supplier Link: #https://www.digikey.ca/product-detail/en/texas-instruments/SN74LVC2G17MDCKREP/296-22358-1-ND/1666931#; PackageReference: SC70; Operating Temperature: -55°C ~ 125°C (TA)

## Sheet Battery Board Connector.SchDoc: Battery Board Header
size Letter; SheetNumber: 16
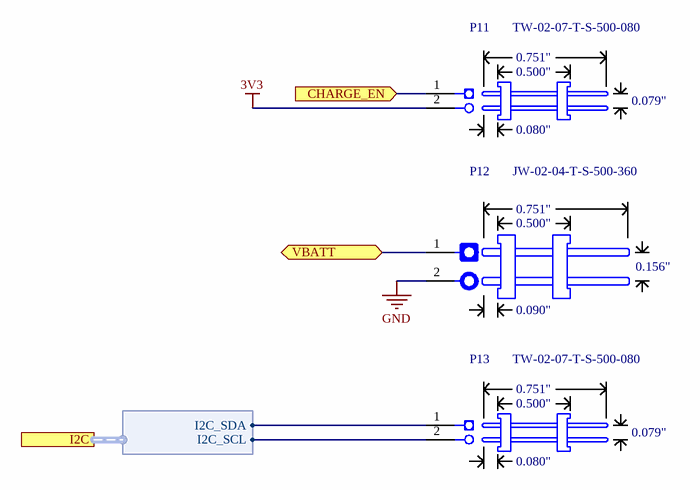
[diagram p21: Battery Board Connector.SchDoc]

### Parts
P11  TW-02-07-T-S-500-080  [SAM-TW-02-07-T-S-500-080]
P12  JW-02-04-T-S-500-360  [SAM-JW-02-04-T-S-500-360]
P13  TW-02-07-T-S-500-080  [SAM-TW-02-07-T-S-500-080]

### Ports
CHARGE_EN (in), I2C (harness TMS570_I2C1), VBATT (bidir)

### Harnesses
TMS570_I2C1: I2C_SCL, I2C_SDA

### Nets
3V3: P11.2
GND: P12.2
VBATT: P12.1 ; port VBATT
CHARGE_EN: P11.1 ; port CHARGE_EN
I2C3.I2C_SCL: P13.2 ; port I2C.I2C_SCL
I2C3.I2C_SDA: P13.1 ; port I2C.I2C_SDA

### Notes on the sheet
- (the "License"); you may not use or redistribute this file except in compliance with the License. You
- This file and the information within it are licensed under the terms of the Apache License, Version 2.0
- Copyright
- Unless required by applicable law or agreed to in writing, content distributed under the License is
- distributed on an "AS IS" BASIS, WITHOUT WARRANTIES OR CONDITIONS OF ANY KIND,
- either express or implied. See the License for the specific language governing permissions and
- limitations under the License.
- may obtain a copy of the License at:
- http://www.apache.org/licenses/LICENSE-2.0
- Title
- Size:
- Date:
- Letter
- Number:
- Time:
- Revision:
- Sheet
- of
- University of Alberta
- Deptartment of Electrical
- and Computer Engineering
- Edmonton AB, Canada
- T6G 1H9
- File:
- (in symbol PP-SAM-00014) 0.751"; 0.500"; 0.079"; 0.080"
- (in symbol PP-SAM-00015) 0.751"; 0.500"; 0.156"; 0.090"

### Library data of the parts
P11 P13 = PP-SAM-00014: CONN BRD STACK 2.00 2POS; Index: 14; Designator: P?; Part Number: PP-SAM-00014; Manufacturer Part Number: TW-02-07-T-S-500-080; Supplier Part Number 1: 200-TW0207TS500080; Supplier 1: Mouser; Publisher: AlbertaSat; Published: 2023-04-18; LatestRevisionDate: 2023-04-18; LatestRevisionNote: ...; Supplier Link: #https://www.digikey.ca/en/products/detail/samtec-inc/TW-02-07-T-S-500-080/9783597#; Operating Temperature: -55°C ~ 125°C
P12 = PP-SAM-00015: .156" Flex Stack, Power Flexible Board Stacker rohs logo; Index: 15; Designator: P?; Part Number: PP-SAM-00015; Manufacturer Part Number: JW-02-04-T-S-500-360; Supplier Part Number 1: JW-02-04-T-S-500-360; Supplier 1: Samtec; Publisher: AlbertaSat; Published: 2023-04-18; LatestRevisionDate: 2023-04-18; LatestRevisionNote: ...; PackageDescription: .156" Flex Stack, Power Flexible Board Stacker rohs logo; Supplier Link: #https://www.samtec.com/products/jw-02-04-t-s-500-360#; Operating Temperature: -55°C ~ 105°C

## Sheet TMP117 Temperature Sensors.SchDoc
size Letter
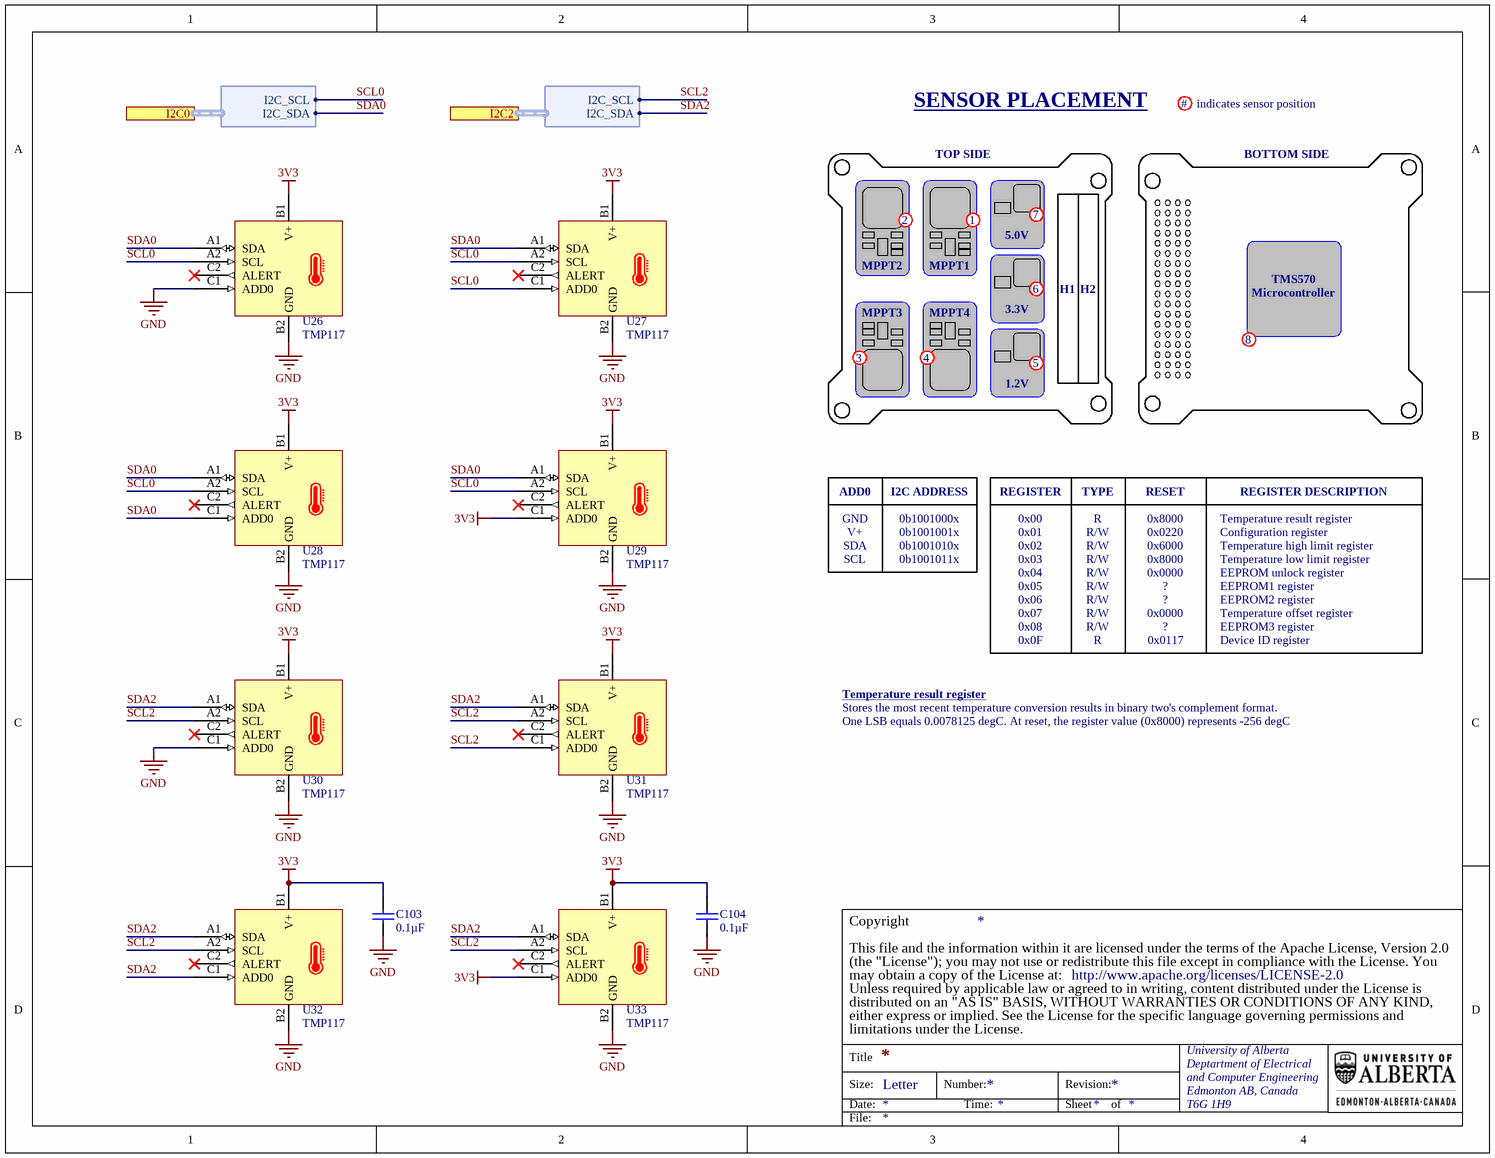
[diagram p22: TMP117 Temperature Sensors.SchDoc]

### Parts
C103  value 0.1µF  [TDK-CGA2B]  (hidden comment: Cap)
C104  value 0.1µF  [TDK-CGA2B]  (hidden comment: Cap)
U26  TMP117  [TI-YBG0006-C01]
U27  TMP117  [TI-YBG0006-C01]
U28  TMP117  [TI-YBG0006-C01]
U29  TMP117  [TI-YBG0006-C01]
U30  TMP117  [TI-YBG0006-C01]
U31  TMP117  [TI-YBG0006-C01]
U32  TMP117  [TI-YBG0006-C01]
U33  TMP117  [TI-YBG0006-C01]

### Ports
I2C0 (harness TCA9548A_I2CIN), I2C2 (harness TCA9548A_I2CIN)

### Harnesses
TCA9548A_I2CIN: I2C_SCL, I2C_SDA

### Nets
3V3: C103.1 C104.1 U26.B1(V+) U27.B1(V+) U28.B1(V+) U29.B1(V+) U29.C1(ADD0) U30.B1(V+) U31.B1(V+) U32.B1(V+) U33.B1(V+) U33.C1(ADD0)
GND: C103.2 C104.2 U26.B2(GND) U26.C1(ADD0) U27.B2(GND) U28.B2(GND) U29.B2(GND) U30.B2(GND) U30.C1(ADD0) U31.B2(GND) U32.B2(GND) U33.B2(GND)
SCL0: U26.A2(SCL) U27.A2(SCL) U27.C1(ADD0) U28.A2(SCL) U29.A2(SCL) ; port I2C0.I2C_SCL  [project net I2C0.I2C_SCL]
SCL2: U30.A2(SCL) U31.A2(SCL) U31.C1(ADD0) U32.A2(SCL) U33.A2(SCL) ; port I2C2.I2C_SCL  [project net I2C2.I2C_SCL]
SDA0: U26.A1(SDA) U27.A1(SDA) U28.A1(SDA) U28.C1(ADD0) U29.A1(SDA) ; port I2C0.I2C_SDA  [project net I2C0.I2C_SDA]
SDA2: U30.A1(SDA) U31.A1(SDA) U32.A1(SDA) U32.C1(ADD0) U33.A1(SDA) ; port I2C2.I2C_SDA  [project net I2C2.I2C_SDA]

Not connected (* = marked no-connect by the designer): U26 C2(ALERT)*; U27 C2(ALERT)*; U28 C2(ALERT)*; U29 C2(ALERT)*; U30 C2(ALERT)*; U31 C2(ALERT)*; U32 C2(ALERT)*; U33 C2(ALERT)*

### Notes on the sheet
- SENSOR PLACEMENT
- #
- indicates sensor position
- TOP SIDE
- BOTTOM SIDE
- 2
- 1
- 5.0V
- 7
- MPPT2
- MPPT1
- 6
- H1
- H2
- TMS570
- Microcontroller
- 3
- MPPT3
- 4
- MPPT4
- 3.3V
- 5
- 8
- 1.2V
- ADD0
- I2C ADDRESS
- REGISTER
- TYPE
- RESET
- REGISTER DESCRIPTION
- GND
- V+
- SDA
- SCL
- 0b1001000x
- 0b1001001x
- 0b1001010x
- 0b1001011x
- 0x00
- 0x01
- 0x02
- 0x03
- 0x04
- R
- R/W
- 0x8000
- 0x0220
- 0x6000
- 0x0000
- Temperature result register
- Configuration register
- Temperature high limit register
- Temperature low limit register
- EEPROM unlock register
- 0x05
- 0x06
- 0x07
- 0x08
- 0x0F
- ?
- 0x0117
- EEPROM2 register
- EEPROM1 register
- EEPROM3 register
- Temperature offset register
- Device ID register
- Stores the most recent temperature conversion results in binary two's complement format.
- One LSB equals 0.0078125 degC. At reset, the register value (0x8000) represents -256 degC
- (the "License"); you may not use or redistribute this file except in compliance with the License. You
- This file and the information within it are licensed under the terms of the Apache License, Version 2.0
- Copyright
- Unless required by applicable law or agreed to in writing, content distributed under the License is
- distributed on an "AS IS" BASIS, WITHOUT WARRANTIES OR CONDITIONS OF ANY KIND,
- either express or implied. See the License for the specific language governing permissions and
- limitations under the License.
- may obtain a copy of the License at:
- http://www.apache.org/licenses/LICENSE-2.0
- Title
- Size:
- Date:
- Letter
- Number:
- Time:
- Revision:
- Sheet
- of
- University of Alberta
- Deptartment of Electrical
- and Computer Engineering
- Edmonton AB, Canada
- T6G 1H9
- File:

### Library data of the parts
C103 C104 = PC-TDK-02259: as C81 on sheet TMS570LS1224 Microcontroller; Published: 2016-03-16; LatestRevisionDate: 2016-03-16; LatestRevisionNote: ...; PackageReference: 0402 (1005 Metric); Publisher: AlbertaSat; PackageDescription: Radial Cap, Thru-Hole; 2 Leads; 0.3 in Pin Spacing; Part Number: PC-TDK-02259; Supplier Part Number 1: 445-6899-1-ND; Supplier 1: Digi-key; Supplier Link: http://www.digikey.ca/product-search/en?keywords=445-6899-1-ND; Voltage - Rated: 50V; Temperature Coefficient: X7R; Applications: Automotive; Operating Temperature: -55°C ~ 125°C
U26-U33 = 164: Temperature Sensor Digital, Local -55°C ~ 150°C 16 b 6-DSBGA (1.49x0.95); Part Number: 164; Voltage - Supply: 1.8V ~ 5.5V; Accuracy - Highest (Lowest): ±0.2°C (±0.3°C); Designator: U?; Supplier Part Number 2: 595-TMP117NAIYBGR; Supplier 2: Mouser; Manufacturer Part Number: TMP117NAIYBGR; Supplier Part Number 1: 296-TMP117NAIYBGRCT-ND; Supplier 1: Digi-Key; Supplier Link: #https://www.digikey.com/en/products/detail/texas-instruments/TMP117NAIYBGR/10434700#; PackageReference: 6-DSBGA (1.49x0.95); Operating Temperature: -55°C ~ 150°C (TA); Sensing Temperature - Local: -55°C ~ 150°C